# EAGLE design nodemcu1_with converter (EAGLE 9.5.2)
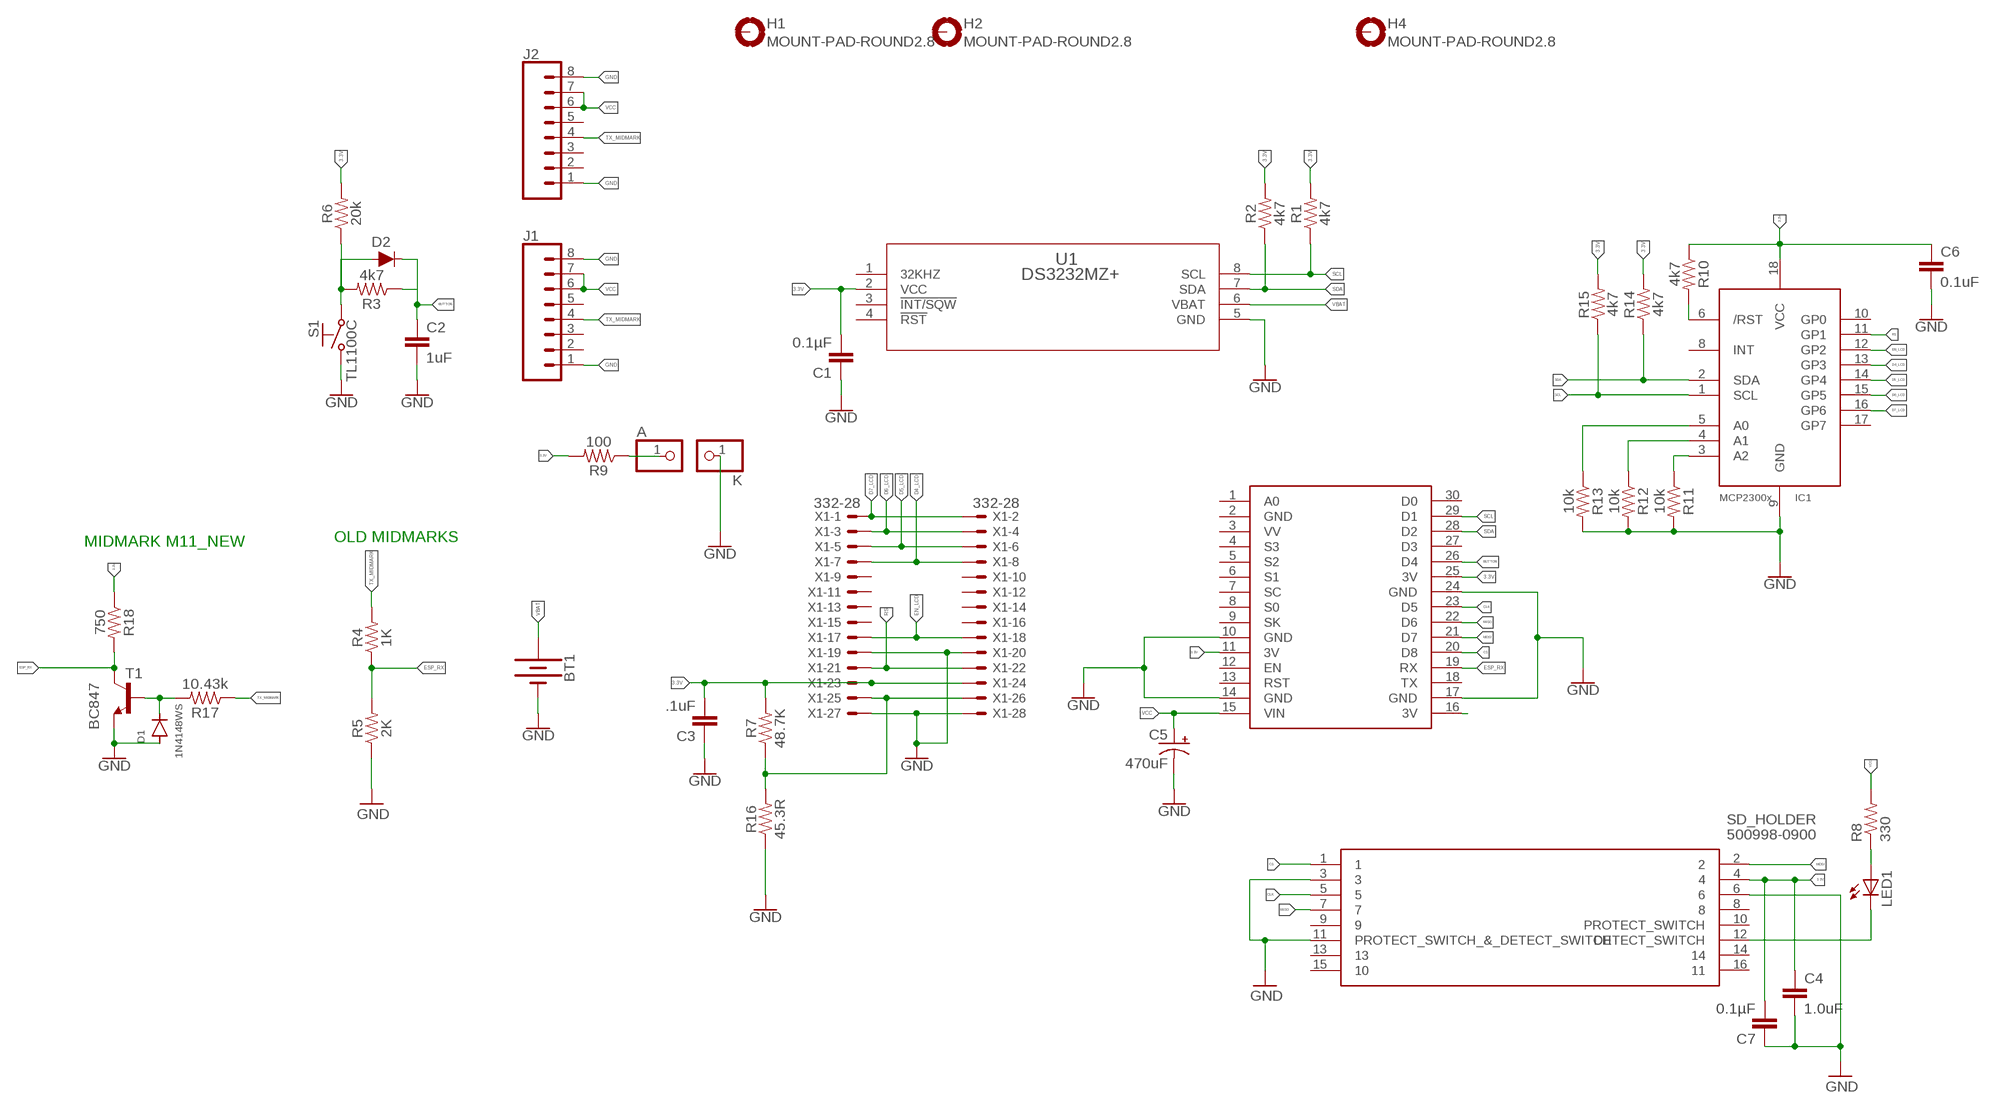
[diagram p0: schematic, sheet 1]

## Parts
A  PINHD-1X1  [1X01]
BT1  BATTERY-20MM_PTH  [BATTCOM_20MM_PTH]
C1  0.1µF  0.33UF/330NF-0805-50V-10%  [0805]
C2  1uF  1.0UF-0805-25V-10%  [0805]
C3  .1uF  1.0UF-0805-25V-10%  [0805]
C4  1.0uF  1.0UF-1206-50V-10%  [1206]
C5  470uF  100UF-POLAR-10X10.5-63V-20%  [NIC_10X10.5_CAP]
C6  0.1uF  1.0UF-0805-25V-10%  [0805]
C7  0.1µF  0.33UF/330NF-0805-50V-10%  [0805]
D1  1N4148WS  [SOD-323]
D2  1A/50V/1.1V  DIODE-PTH  [DIODE-1N4001]
H1  MOUNT-PAD-ROUND2.8  [2,8-PAD]
H2  MOUNT-PAD-ROUND2.8  [2,8-PAD]
H4  MOUNT-PAD-ROUND2.8  [2,8-PAD]
IC1  MCP23008/P  [DIL18]
J1  CONN_08"  [1X08]
J2  CONN_08"  [1X08]
K  PINHD-1X1  [1X01]
LED1  LEDSIDELED  [OSRAM-SIDELED]
R1  4k7  0.22OHM-0805-1/4W-1%  [0805]
R2  4k7  0.22OHM-0805-1/4W-1%  [0805]
R3  4k7  0.22OHM-0805-1/4W-1%  [0805]
R4  1K  0.22OHM-0805-1/4W-1%  [0805]
R5  2K  0.22OHM-0805-1/4W-1%  [0805]
R6  20k  0.22OHM-0805-1/4W-1%  [0805]
R7  48.7K  0.22OHM-0805-1/4W-1%  [0805]
R8  330  R-US_R0805  [R0805]
R9  100  0.22OHM-0805-1/4W-1%  [0805]
R10  4k7  0.22OHM-0805-1/4W-1%  [0805]
R11  10k  0.22OHM-0805-1/4W-1%  [0805]
R12  10k  0.22OHM-0805-1/4W-1%  [0805]
R13  10k  0.22OHM-0805-1/4W-1%  [0805]
R14  4k7  0.22OHM-0805-1/4W-1%  [0805]
R15  4k7  0.22OHM-0805-1/4W-1%  [0805]
R16  45.3R  0.22OHM-0805-1/4W-1%  [0805]
R17  10.43k  0.22OHM-0805-1/4W-1%  [0805]
R18  750  0.22OHM-0805-1/4W-1%  [0805]
S1  TL1100C  [TL1100C]
SD_HOLDER  500998-0900  [5009980900]
T1  BC847  [SOT23]
U1  DS3232MZ+  [21-0041B_8]
U$1  NODEMCU  [NODEMCU]
X1  332-28  [332-28]

## Nets
3.3V [power]: C1.2 C3.2 C4.1 C6.1 C7.2 IC1.18(VCC) R1.2 R2.2 R6.2 R7.2 R9.2 R10.1 R14.2 R15.2 R18.1 SD_HOLDER.4 U1.2(VCC) U$1.11(3V) U$1.25(3V) X1.23 X1.24
BUTTON [power]: C2.1 D2.C R3.1 U$1.26(D4)
CLK [signal]: SD_HOLDER.5 U$1.23(D5)
CS [signal]: SD_HOLDER.1 U$1.20(D8)
D4_LCD [signal]: IC1.13(GP3) X1.7 X1.8
D5_LCD [signal]: IC1.14(GP4) X1.5 X1.6
D6_LCD [signal]: IC1.15(GP5) X1.3 X1.4
D7_LCD [signal]: IC1.16(GP6) X1.1 X1.2
EN_LCD [signal]: IC1.12(GP2) X1.17 X1.18
ESP_RX [signal]: R4.1 R5.2 R18.2 T1.3(C) U$1.19(RX)
GND [power]: BT1.2(-) C1.1 C2.2 C3.1 C4.2 C5.- C6.2 C7.1 D1.A IC1.9(GND) J1.1 J1.8 J2.1 J2.8 K.1 R5.1 R11.2 R12.2 R13.2 R16.1 S1.2(S) SD_HOLDER.3 SD_HOLDER.6 SD_HOLDER.11(PROTECT_SWITCH_&_DETECT_SWITCH) T1.2(E) U1.5(GND) U$1.10(GND) U$1.14(GND) U$1.17(GND) U$1.24(GND) X1.19 X1.20 X1.27 X1.28
MISO [signal]: SD_HOLDER.7 U$1.22(D6)
MOSI [signal]: SD_HOLDER.2 U$1.21(D7)
N$1: D2.A R3.2 R6.1 S1.1(P)
N$3 [power]: A.1 R9.1
N$4: IC1.6(/RST) R10.2
N$5: IC1.3(A2) R11.1
N$6 [signal]: R7.1 R16.2 X1.25 X1.26
N$7: IC1.4(A1) R12.1
N$8: IC1.5(A0) R13.1
N$9: U$1.16(3V)
N$10: D1.C R17.2 T1.1(B)
N$25: LED1.C SD_HOLDER.12(DETECT_SWITCH)
N$31 [power]: LED1.A R8.1
RS [signal]: IC1.11(GP1) X1.21 X1.22
SCL [signal]: IC1.1(SCL) R1.1 R15.1 U1.8(SCL) U$1.29(D1)
SDA [signal]: IC1.2(SDA) R2.1 R14.1 U1.7(SDA) U$1.28(D2)
TX_MIDMARK [power]: J1.4 J2.4 R4.2 R17.1
VBAT [power]: BT1.1(+) U1.6(VBAT)
VCC [power]: C5.+ J1.6 J1.7 J2.6 J2.7 R8.2 U$1.15(VIN)
Unconnected: H1.B2,8(MOUNT) H2.B2,8(MOUNT) H4.B2,8(MOUNT) IC1.8(INT) IC1.10(GP0) IC1.17(GP7) J1.2 J1.3 J1.5 J2.2 J2.3 J2.5 SD_HOLDER.8 SD_HOLDER.9 SD_HOLDER.10(PROTECT_SWITCH) SD_HOLDER.13 SD_HOLDER.14 SD_HOLDER.15 SD_HOLDER.16 U1.1(32KHZ) U1.3(!INT/SQW) U1.4(!RST) U$1.1(A0) U$1.3(VV) U$1.4(S3) U$1.5(S2) U$1.6(S1) U$1.7(SC) U$1.8(S0) U$1.9(SK) U$1.12(EN) U$1.13(RST) U$1.18(TX) U$1.27(D3) U$1.30(D0) X1.9 X1.10 X1.11 X1.12 X1.13 X1.14 X1.15 X1.16

## Notes on the sheet
- MIDMARK M11_NEW | OLD MIDMARKS

## Power pins joined to a net without a drawn wire
GND: U$1.2(GND)

## Library data of the parts
A K = pinhead:PINHD-1X1: PIN HEADER
BT1 = SparkFun-Batteries:BATTERY: Battery - Single Cell A variety of battery chemistries, sizes, and footprints. Device List: 20MM_PTH - Coin Cell Battery Holder - 20mm (PTH) <https://www.sparkfun.com/products/783> 20MM_PTH_KIT- Coin Cell battery Holder - 20 mm (PTH) <http://www.sparkfun.com/products/783>kit version with special mask 6.8MM_PTH - Coin Cell Battery Holder - 6.8MM(SMD) <https://www.digikey.com/product-detail/en/seiko-instruments/MS621FE-FL11E/728-1057-ND/1889208?WT.srch=1&gclid=CNOQ5a6LzdQCFZS2wAodXCkE0g> 12MM_SMD - Coin Cell Battery Holder - 12mm (SMD) <https://www.sparkfun.com/products/10592> 12MM_PTH - Coin Cell Battery Holder - 12mm (PTH) <https://www.sparkfun.com/products/7948> 20MM_SMD - 20mm Coin Cell Battery Holder (SMD) (2 legs) Used on the Big Time Watch Kit <https://www.sparkfun.com/products/11734> 20MM_SMD_4LEGS - Coin Cell Battery Holder - 20mm (SMD) <https://www.sparkfun.com/products/11892> 20MM_SMD_4LEGS_OVERPASTE - Coin Cell Battery Holder - 20mm (SMD) <https://www.sparkfun.com/products/11892> (Over-paste on the legs) 24.5MM_PTH - Coin Cell Battery Holder - 24.5mm (PTH) <https://www.sparkfun.com/products/8863> 9V - 9V Battery Holder - PC Mount Used on the SparkFun SparkPunk Sound Kit <https://www.sparkfun.com/products/11177> and SparkFun SparkPunk Sequencer Kit <https://www.sparkfun.com/products/12707> 18650 - Battery Holder - 18650 (PTH) <https://www.sparkfun.com/products/13113> AA - Battery Holder - 1xAA (PTH) <https://www.sparkfun.com/products/7949> AAA - Battery Holder - 1xAAA (PTH) <https://www.sparkfun.com/products/12718> AA_KIT - Battery Holder - 1xAA (PTH) <https://www.sparkfun.com/products/7949> Special kit package - pads only have exposed copper on one side of the board. AAA_KIT - Battery Holder - 1xAAA (PTH) <https://www.sparkfun.com/products/12718> Special kit package - pads only have exposed copper on one side of the board.; PROD_ID: BATT-09031; SF_SKU: PRT-00783
C1 C7 = SparkFun-Capacitors:0.33UF/330NF: 0.33µF/330nF ceramic capacitors A capacitor is a passive two-terminal electrical component used to store electrical energy temporarily in an electric field.; PROD_ID: CAP-08469; VALUE: 0.33µF
C2 C3 C6 = SparkFun-Capacitors:1.0UF: 1µF ceramic capacitors A capacitor is a passive two-terminal electrical component used to store electrical energy temporarily in an electric field.; PROD_ID: CAP-08064; VALUE: 1.0uF
C4 = SparkFun-Capacitors:1.0UF: 1µF ceramic capacitors A capacitor is a passive two-terminal electrical component used to store electrical energy temporarily in an electric field.; PROD_ID: CAP-09822
C5 = SparkFun-Capacitors:100UF-POLAR: 100µF polarized capacitors A capacitor is a passive two-terminal electrical component used to store electrical energy temporarily in an electric field.; PROD_ID: CAP-08362; VALUE: 100uF
D1 = Diodes:1N4148WS: DIODE GEN PURP 75V 150MA SOD323F Manufacturer's datasheet <https://www.onsemi.com/pub/Collateral/1N914BWS-D.pdf>; CREATED_BY: PCBLayout.com; DIGIKEY_PART_NUMBER: 1N4148WSFSTR-ND; MANUFACTURER: Diodes Incorporated; MPN: 1N4148WS; PACKAGE: SOD-323
D2 = SparkFun-DiscreteSemi:DIODE: Diode These are standard reverse protection diodes and small signal diodes. SparkFun Products: SparkFun SparkPunk Sound Kit <https://www.sparkfun.com/products/11177> SparkFun ESP8266 Thing <https://www.sparkfun.com/products/13231>; PROD_ID: DIO-09176
H1 H2 H4 = holes:MOUNT-PAD-ROUND: MOUNTING PAD, round
IC1 = adafruit:MCP23008: MCP23008 Inexpensive i2c i/o expander - 8 general purpose i/o pins with optional pullups
J1 J2 = SparkFun-Connectors:CONN_08: Multi connection point. Often used as Generic Header-pin footprint for 0.1 inch spaced/style header connections On any of the 0.1 inch spaced packages, you can populate with these: Break Away Headers - Straight <https://www.sparkfun.com/products/116> (PRT-00116) Break Away Male Headers - Right Angle <https://www.sparkfun.com/products/553> (PRT-00553) Female Headers <https://www.sparkfun.com/products/115> (PRT-00115) Break Away Headers - Machine Pin <https://www.sparkfun.com/products/117> (PRT-00117) Break Away Female Headers - Swiss Machine Pin <https://www.sparkfun.com/products/743> (PRT-00743) Arduino Stackable Header - 8 Pin <https://www.sparkfun.com/products/9279> (PRT-09279) For SCREWTERMINALS and SPRING TERMINALS visit here: Screw Terimnals on SparkFun.com <https://www.sparkfun.com/search/results?term=Screw+Terminals> (5mm/3.5mm/2.54mm spacing) This device is also useful as a general connection point to wire up your design to another part of your project. Our various solder wires solder well into these plated through hole pads. Hook-Up Wire - Assortment (Stranded, 22 AWG) <https://www.sparkfun.com/products/11375> (PRT-11375) Hook-Up Wire - Assortment (Solid Core, 22 AWG) <https://www.sparkfun.com/products/11367> (PRT-11367) View the entire wire category on our website here <https://www.sparkfun.com/categories/141> Special notes: Molex polarized connector foot print use with SKU : PRT-08231 with associated crimp pins and housings. 1MM SMD Version SKU: PRT-10208 NOTES ON THE VARIANTS LOCK and LOCK_LONGPADS... This footprint was designed to help hold the alignment of a through-hole component (i.e. 6-pin header) while soldering it into place. You may notice that each hole has been shifted either up or down by 0.005 of an inch from it's more standard position (which is a perfectly straight line). This slight alteration caused the pins (the squares in the middle) to touch the edges of the holes. Because they are alternating, it causes a "brace" to hold the component in place. 0.005 has proven to be the perfect amount of "off-center" position when using our standard breakaway headers. Although looks a little odd when you look at the bare footprint, once you have a header in there, the alteration is very hard to notice. Also,if you push a header all the way into place, it is covered up entirely on the bottom side.; PROD_ID: CONN-08438
LED1 = adafruit:LED: LED OSRAM: - CHIPLED LG R971, LG N971, LY N971, LG Q971, LY Q971, LO R971, LY R971 LH N974, LH R974 LS Q976, LO Q976, LY Q976 LO Q996 - Hyper CHIPLED LW Q18S LB Q993, LB Q99A, LB R99A - SideLED LS A670, LO A670, LY A670, LG A670, LP A670 LB A673, LV A673, LT A673, LW A673 LH A674 LY A675 LS A676, LA A676, LO A676, LY A676, LW A676 LS A679, LY A679, LG A679 - Hyper Micro SIDELED® LS Y876, LA Y876, LO Y876, LY Y876 LT Y87S - SmartLED LW L88C, LW L88S LB L89C, LB L89S, LG L890 LS L89K, LO L89K, LY L89K LS L896, LA L896, LO L896, LY L896 - TOPLED LS T670, LO T670, LY T670, LG T670, LP T670 LSG T670, LSP T670, LSY T670, LOP T670, LYG T670 LG T671, LOG T671, LSG T671 LB T673, LV T673, LT T673, LW T673 LH T674 LS T676, LA T676, LO T676, LY T676, LB T676, LH T676, LSB T676, LW T676 LB T67C, LV T67C, LT T67C, LS T67K, LO T67K, LY T67K, LW E67C LS E67B, LA E67B, LO E67B, LY E67B, LB E67C, LV E67C, LT E67C LW T67C LS T679, LY T679, LG T679 LS T770, LO T770, LY T770, LG T770, LP T770 LB T773, LV T773, LT T773, LW T773 LH T774 LS E675, LA E675, LY E675, LS T675 LS T776, LA T776, LO T776, LY T776, LB T776 LHGB T686 LT T68C, LB T68C - Hyper Mini TOPLED® LB M676 - Mini TOPLED Santana® LG M470 LS M47K, LO M47K, LY M47K Source: http://www.osram.convergy.de/
R1-R7 R9-R18 = SparkFun-Resistors:0.22OHM: 0.22Ω resistor A resistor is a passive two-terminal electrical component that implements electrical resistance as a circuit element. Resistors act to reduce current flow, and, at the same time, act to lower voltage levels within circuits. - Wikipedia; PROD_ID: RES-09883; VALUE: 0.22
R8 = rcl:R-US_: RESISTOR, American symbol; SPICEPREFIX: R
S1 = switch-e-switch:TL1100C: TACTILE SWITCH
SD_HOLDER = SamacSys_Parts:500998-0900: 9 way normal mount SD card connector 9 way normal mount SD card connector Source: Datasheet <https://componentsearchengine.com/Datasheets/1/500998-0900.pdf>; ALLIED_NUMBER: 70266950; ALLIED_PRICE-STOCK: https://www.alliedelec.com/molex-incorporated-500998-0900/70266950/; DESCRIPTION: 9 way normal mount SD card connector 9 way normal mount SD card connector; HEIGHT: 3mm; MANUFACTURER_NAME: Molex; MANUFACTURER_PART_NUMBER: 500998-0900; MOUSER_PART_NUMBER: 538-500998-0900; MOUSER_PRICE-STOCK: https://www.mouser.com/Search/Refine.aspx?Keyword=538-500998-0900; RS_PART_NUMBER: 4879327; RS_PRICE-STOCK: http://uk.rs-online.com/web/p/products/4879327
T1 = transistor:BC847: NPN TRANSISTOR
U1 = ds3232:DS3232MZ+: DS3232; BUILT_BY: EMA_UL_Team; MANUFACTURER_PART_NUMBER: DS3232MZ+; VENDOR: Maxim Integrated Products
U$1 = nodemcu:NODEMCU
X1 = con-garry:332-28: 28 Pin - 2mm Dual Row Source: www.mpe-connector.de / garry_shortform_2012.pdf

## Net classes
1 signal: width 0.254 mm, drill 0.305 mm, clearance 0.305 mm
2 power: width 0.508 mm, drill 0.61 mm, clearance 0.305 mm

## Board
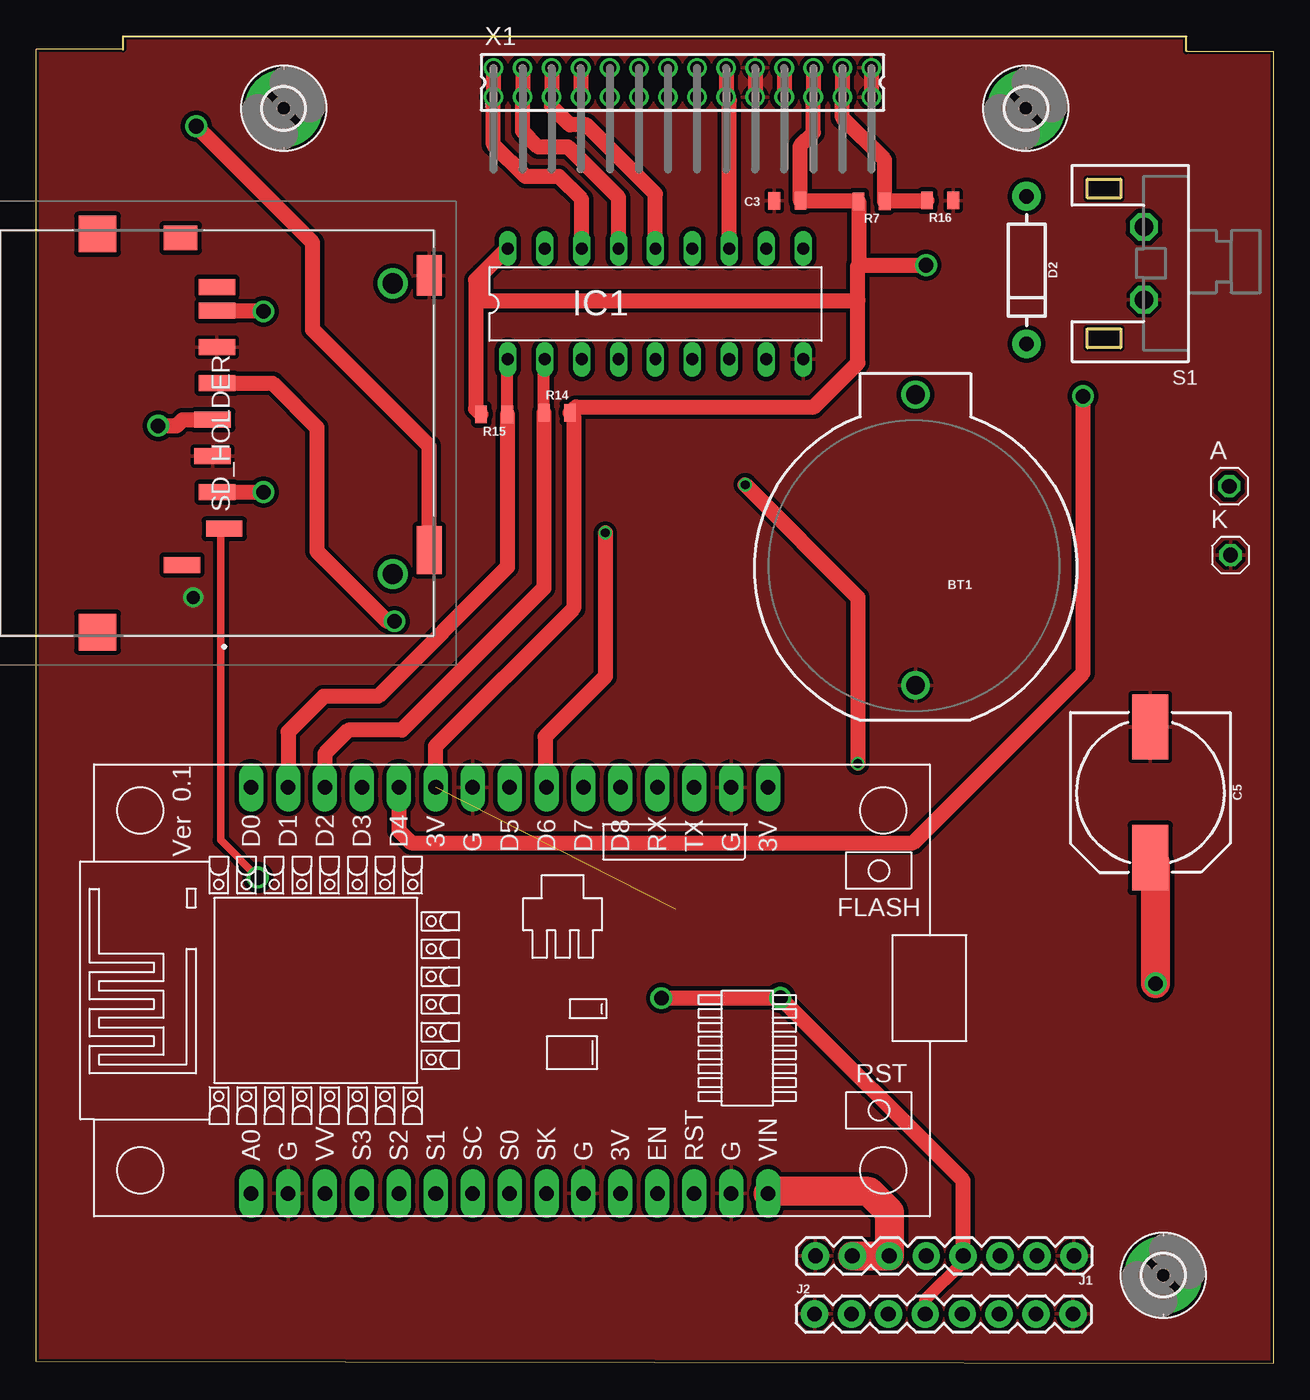
[diagram p1: board, top side]
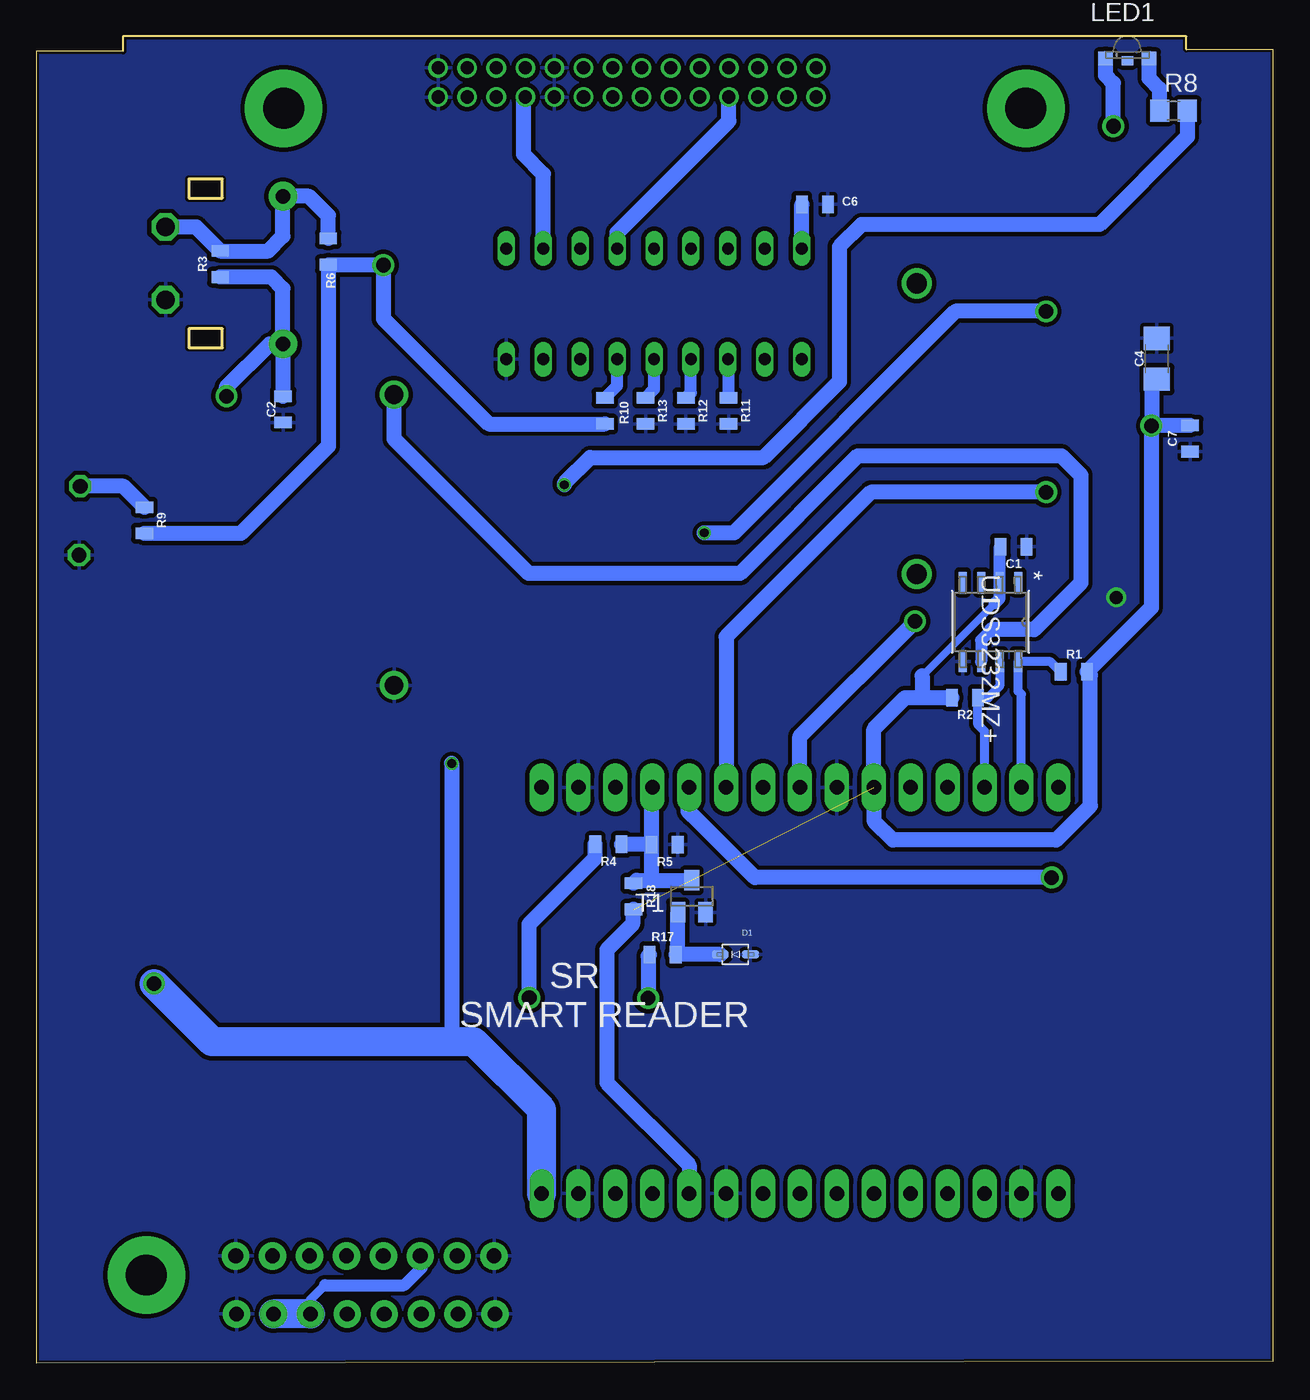
[diagram p2: board, bottom side, seen from below]

Size 85.09 x 91.31 mm. Coordinates in mm from the lower left corner, seen from the top.
Outline: 5.97,91.31 79.12,91.31 79.12,90.3 85.09,90.3 85.09,0 0,0.13 0,90.42 5.97,90.42 5.97,91.31
Copper layers (1*16): Top 0.035mm / dielectric 1.5mm / Bottom 0.035mm
Design rules "SparkFun-2-layer-PCBWay-LIMIT": minimum track width 6mil, minimum drill 0.3mm, track to track 6mil, track to pad 6mil, pad to pad 6mil, via to via 6mil, smd to smd 6mil, copper to edge 6mil, drill to drill 6mil, minimum pad ring 6mil, minimum via ring 6mil, stop-mask expansion 4mil, vias tented up to drill 25mil, thermal gap 10mil

### Footprints (pad centres in the part's own frame; a part is rotated, then mirrored left to right if it is on the bottom)
1X01 = drill 1.016 octagon: 1 0,0
BATTCOM_20MM_PTH = drill 1.3: 1 11.85,0; 2 -8.15,0
0805 = smd 0.8 x 1.2: 1 -0.9,0; 2 0.9,0
1206 = smd 1.6 x 1.8: 1 -1.4,0; 2 1.4,0
NIC_10X10.5_CAP = smd 4.5 x 2.5: + 4.5,0; - -4.5,0
SOD-323 = smd 1.14 x 0.52: A 1.04,0; C -1.04,0
DIODE-1N4001 = drill 1 pad 1.981: A -5.08,0; C 5.08,0
2,8-PAD = drill 2.8 pad 5.334: B2,8 0,0
DIL18 = drill 0.813 long: 1 -10.16,-3.81; 2 -7.62,-3.81; 3 -5.08,-3.81; 4 -2.54,-3.81; 5 0,-3.81; 6 2.54,-3.81; 7 5.08,-3.81; 8 7.62,-3.81; 9 10.16,-3.81; 10 10.16,3.81; 11 7.62,3.81; 12 5.08,3.81; 13 2.54,3.81; 14 0,3.81; 15 -2.54,3.81; 16 -5.08,3.81; 17 -7.62,3.81; 18 -10.16,3.81
1X08 = drill 1.016 pad 1.88: 1 0,0; 2 2.54,0; 3 5.08,0; 4 7.62,0; 5 10.16,0; 6 12.7,0; 7 15.24,0; 8 17.78,0
OSRAM-SIDELED = smd 1 x 0.9: A 1.5,0; C -1.5,0 | smd 0.8 x 0.6: P$1 0,-0.15
R0805 = smd 1.3 x 1.5: 1 -0.95,0; 2 0.95,0
TL1100C = drill 1.27 octagon: 1 2.5,0; 2 -2.5,0
5009980900 = smd 1.1 x 2.5: 1 -6.575,-0.225; 2 -4.075,0.275; 3 -1.575,0.575; 4 0.925,0.575; 5 3.425,0.275; 6 5.925,0.275; 7 8.425,0.275; 8 10.05,0.275; 9 -9.075,2.675 | smd 1.7 x 2.3: 10 13.425,2.775 | smd 2.8 x 1.7: 11 10.85,-14.325 | smd 3.3 x 1.7: 12 -8.05,-14.325 | smd 2.5 x 2.6: 13 -13.7,8.495; 14 13.7,8.495 | drill 1.39 pad 2.085: 15 -9.7,-11.825; 16 10.3,-11.825
SOT23 = smd 1 x 1.4: 1 -0.95,-1.1; 2 0.95,-1.1; 3 0,1.1
21-0041B_8 = smd 1.455 x 0.543: 1 -2.721,1.905; 2 -2.721,0.635; 3 -2.721,-0.635; 4 -2.721,-1.905; 5 2.721,-1.905; 6 2.721,-0.635; 7 2.721,0.635; 8 2.721,1.905
NODEMCU = drill 1 pad 1.676 long: 1 -13.97,17.78; 2 -13.97,15.24; 3 -13.97,12.7; 4 -13.97,10.16; 5 -13.97,7.62; 6 -13.97,5.08; 7 -13.97,2.54; 8 -13.97,0; 9 -13.97,-2.54; 10 -13.97,-5.08; 11 -13.97,-7.62; 12 -13.97,-10.16; 13 -13.97,-12.7; 14 -13.97,-15.24; 15 -13.97,-17.78; 16 13.97,-17.78; 17 13.97,-15.24; 18 13.97,-12.7; 19 13.97,-10.16; 20 13.97,-7.62; 21 13.97,-5.08; 22 13.97,-2.54; 23 13.97,0; 24 13.97,2.54; 25 13.97,5.08; 26 13.97,7.62; 27 13.97,10.16; 28 13.97,12.7; 29 13.97,15.24; 30 13.97,17.78
332-28 = drill 0.9 pad 1.27: 1 -13,-1; 2 -13,1; 3 -11,-1; 4 -11,1; 5 -9,-1; 6 -9,1; 7 -7,-1; 8 -7,1; 9 -5,-1; 10 -5,1; 11 -3,-1; 12 -3,1; 13 -1,-1; 14 -1,1; 15 1,-1; 16 1,1; 17 3,-1; 18 3,1; 19 5,-1; 20 5,1; 21 7,-1; 22 7,1; 23 9,-1; 24 9,1; 25 11,-1; 26 11,1; 27 13,-1; 28 13,1

### Placement (x,y rotation side)
A  82.07,60.35 0 top
BT1  60.48,54.8 90 top
C1  17.86,56.19 180 bottom
C2  68.11,65.64 270 bottom
C3  51.67,79.99 0 top
C4  8,69.13 90 bottom
C5  76.63,39.28 270 top
C6  31.53,79.76 0 bottom
C7  5.71,63.64 90 bottom
D1  37,28.13 0 bottom
D2  68.12,75.23 270 top
H1  17.02,86.36 0 top
H2  68.07,86.36 0 top
H4  77.53,6.06 0 top
IC1  42.59,72.9 0 top
J1  71.38,7.38 180 top
J2  53.54,3.38 0 top
K  82.15,55.61 0 top
LED1  10.03,89.79 0 bottom
R1  13.71,47.57 0 bottom
R2  21.2,45.81 180 bottom
R3  72.44,75.64 90 bottom
R4  45.74,35.7 180 bottom
R5  41.87,35.68 180 bottom
R6  65.01,76.5 270 bottom
R7  57.47,79.96 180 top
R8  6.85,86.2 0 bottom
R9  77.66,58.01 270 bottom
R10  45.97,65.53 90 bottom
R11  37.47,65.53 270 bottom
R12  40.4,65.53 270 bottom
R13  43.18,65.53 270 bottom
R14  35.81,65.41 0 top
R15  31.5,65.3 180 top
R16  62.18,80.01 180 top
R17  42,28.13 0 bottom
R18  44,32.13 90 bottom
S1  76.2,75.69 90 top
SD_HOLDER  12.7,64.01 90 top
T1  40,32.13 0 bottom
U1  19.45,51.01 270 bottom
U$1  32.56,25.65 90 top
X1  44.45,88.14 0 top

### Tracks (layer width: path | path; a pad name or v marks a point on that pad's centre or on a via)
3.3V  (via drill 1)  (1 unrouted)
  Top 0.508: 32.38,76.71 IC1.18
  Top 1.016: v8.38,64.52 9.65,64.52 10.07,64.93 SD_HOLDER.4 | X1.24 X1.23 53.45,84.69 52.57,83.81 C3.2 56.53,79.99 R7.2 56.57,75.56 | 56.57,75.56 56.52,75.56 56.52,73.13 | 56.57,75.56 v61.21,75.56 | 30.63,74.95 30.63,73.13 56.52,73.13 | 32.38,76.71 30.63,74.95 | U$1.25 27.48,42.46 36.96,51.94 36.96,65.16 R14.2 37.11,65.8 53.48,65.8 56.52,68.83 56.52,73.13 | R15.2 30.22,65.68 30.22,74.54 30.63,74.95
  Bottom 0.508: 19.16,52.29 24.16,47.3
  Bottom 0.813: C6.1 | 19.16,52.29 18.82,52.63 U1.2 18.82,56.13 C1.2
  Bottom 1.016: C7.2 8.36,64.54 | 8.36,64.54 v8.38,64.52 8.38,52 R1.2 12.57,47.33 12.57,38.35 14.94,35.99 26.16,35.99 27.43,37.26 27.43,39.67 U$1.25 27.48,43.64 25.31,45.81 24,45.81 | C4.1 8.36,67.37 8.36,64.54 | IC1.18 C6.1 | 24,45.81 R2.2 | 24.16,47.3 24.16,45.96 24,45.81 | R9.2 71.01,57.11 65.01,63.11 R6.2 64.97,75.56 v61.21,75.56 61.21,71.88 53.96,64.63 R10.1 | R18.1 44.07,31.16 44.07,30.23 45.85,28.45 45.85,19.3 40.18,13.63 U$1.11
BUTTON  (via drill 1)
  Top 1.016: U$1.26 24.94,36.66 25.78,35.81 60.33,35.81 72.01,47.5 v72.01,66.55
  Bottom 1.016: D2.C 68.12,73.96 68.9,74.74 R3.1 | D2.C 68.12,66.56 C2.1 | v72.01,66.55 72.01,67.18 69.05,70.15 D2.C
CLK  (via drill 1)
  Top 1.016: v24.64,51.05 24.13,51.05 19.3,55.88 19.3,64.39 16.26,67.43 SD_HOLDER.5
  Bottom 1.016: U$1.23 32.56,43.14 v24.64,51.05
CS  (via drill 1)
  Top 0.508: v15.24,33.43 12.67,36 12.67,57.18 SD_HOLDER.1
  Bottom 1.016: v15.24,33.43 35.66,33.43 40.01,37.77 40.01,37.72 40.26,37.97 40.26,39.54 U$1.20
D4_LCD
  Top 1.016: X1.8 X1.7
  Bottom 1.016: IC1.13 45.13,77.8 37.45,85.49 X1.7
D5_LCD
  Top 1.016: X1.6 X1.5 35.45,86.47 36.7,85.22 37.85,85.22 42.59,80.47 IC1.14
D6_LCD
  Top 1.016: X1.4 X1.3 33.45,84.79 34.54,83.69 36.58,83.69 40.05,80.22 IC1.15
D7_LCD
  Top 1.016: X1.2 X1.1 31.45,83.87 33.66,81.66 35.94,81.66 37.51,80.09 IC1.16
EN_LCD
  Top 1.016: X1.18 X1.17 47.67,86.91 IC1.12
ESP_RX
  Bottom 1.016: R5.2 44.82,35.68 R4.1 | R5.2 42.77,39.58 U$1.19 | R18.2 43.8,33.23 43,33.23 | 43,33.23 T1.3 | 43,33.23 42.77,33.46 R5.2
GND  (via drill 0.9)
  Top 1.016: X1.28 X1.27 | X1.20 X1.19
  other vias: 10.79,52.71
  pour Top: -2,96.13 94,96.13 94,-5.87 -6,-5.87 -7,-4.87 -7,96.13
  pour Bottom: -7,96.13 94,96.13 94,-5.87 -6,-5.87 -7,-4.87
MISO  (via drill 0.61, 1)
  Top 0.813: 15.58,72.43 v15.62,72.39
  Top 1.016: SD_HOLDER.7 15.58,72.43 | v39.14,57.14 39.14,47.27 35,43.13 35,39.72 U$1.22
  Bottom 1.016: v15.62,72.39 21.86,72.39 37.11,57.14 v39.14,57.14
MOSI  (via drill 1)
  Top 1.016: SD_HOLDER.2 15.61,59.93 v15.62,59.94
  Bottom 1.016: v15.62,59.94 27.69,59.94 37.64,49.99 U$1.21
N$1
  Bottom 1.016: S1.1 74.08,78.19 R3.2 69.12,76.54 68.12,77.55 D2.A 66.34,80.31 65.01,78.98 R6.1
N$3
  Bottom 1.016: R9.1 79.1,60.35 A.1
N$4
  Bottom 0.813: R10.2 45.13,67.27 IC1.6
N$5
  Bottom 0.813: R11.1 37.47,69.04 IC1.3
N$6
  Top 1.016: R16.2 58.42,80.01 R7.1 58.37,82.81 55.45,85.73 X1.25 X1.26
N$7
  Bottom 0.813: R12.1 40.05,66.78 IC1.4
N$8
  Bottom 0.813: R13.1 42.59,67.02 IC1.5
N$10
  Bottom 1.016: T1.1 40.95,28.28 R17.2 D1.C
N$25  (via drill 1)
  Top 1.016: SD_HOLDER.12 27.02,63.1 19,71.13 19,77.13 v11,85.13
  Bottom 1.016: v11,85.13 11,88.09 11.53,88.62 LED1.C
N$31
  Bottom 1.016: R8.1 7.8,87.68 8.53,88.42 LED1.A
RS
  Top 1.016: X1.22 X1.21
  Bottom 1.016: IC1.11 50.21,81.84 51.56,83.19 51.56,87.03 X1.21
SCL
  Top 0.813: R15.1 32.4,69.05 IC1.1
  Top 1.016: R15.1 32.4,54.78 23.51,45.89 19.76,45.89 17.32,43.44 U$1.29
  Bottom 0.61: U$1.29 17.32,46.02 17.55,46.25 U1.8 15.33,48.29 R1.1
SDA
  Top 0.813: R14.1 34.91,69.03 IC1.2
  Top 1.016: R14.1 34.91,53.33 25.15,43.56 21.46,43.56 19.86,41.96 U$1.28
  Bottom 0.61: U1.7 18.82,46.59 19.6,45.81 R2.1 | U$1.28 19.86,43.48 20.32,43.94 20.32,45.79
  Bottom 0.813: 20.32,45.79 R2.1
TX_MIDMARK  (via drill 1)
  Top 0.813: J2.4 61.16,4.39 63.76,6.99 J1.4
  Top 1.016: J1.4 63.76,12.57 v51.18,25.15 43.02,25.15 v43,25.13
  Bottom 1.016: v51.18,25.15 51.18,30.23 46.64,34.76 R4.2 | R17.1 43,28.03 v43,25.13
VBAT
  Bottom 0.813: U1.6 20.09,49.76 19.37,50.48
  Bottom 1.016: 19.37,50.48 16.45,50.48 13.23,53.7 13.23,61.11 14.58,62.46 28.57,62.46 36.68,54.36 51.23,54.36 60.48,63.61 BT1.1
VCC  (via drill 0.61, 1)
  Top 1.016: v48.77,60.45 56.52,52.71 v56.52,41.28
  Top 2: v77,26.13 77,34.41 C5.+ | U$1.15 50.46,11.81 57.28,11.81 58.68,10.41 J1.6 J1.7
  Bottom 0.61: J2.6 66.24,4.38 65.24,5.37
  Bottom 0.813: J1.6 58.55,7.25 58.55,6.6 59.78,5.37 65.24,5.37
  Bottom 1.016: R8.2 5.9,84.4 11.94,78.36 28.32,78.36 29.84,76.83 29.84,67.54 35.05,62.33 47,62.33 48.77,60.56 v48.77,60.45 | v56.52,41.28 56.52,22.25 56.39,22.13
  Bottom 2: U$1.15 50.34,17.46 55,22.13 56.39,22.13 73,22.13 v77,26.13 | J2.6 J2.7

### Text on the board
bPlace: SR / SMART READER